# EAGLE schematic measure_board (EAGLE 7.2.0)
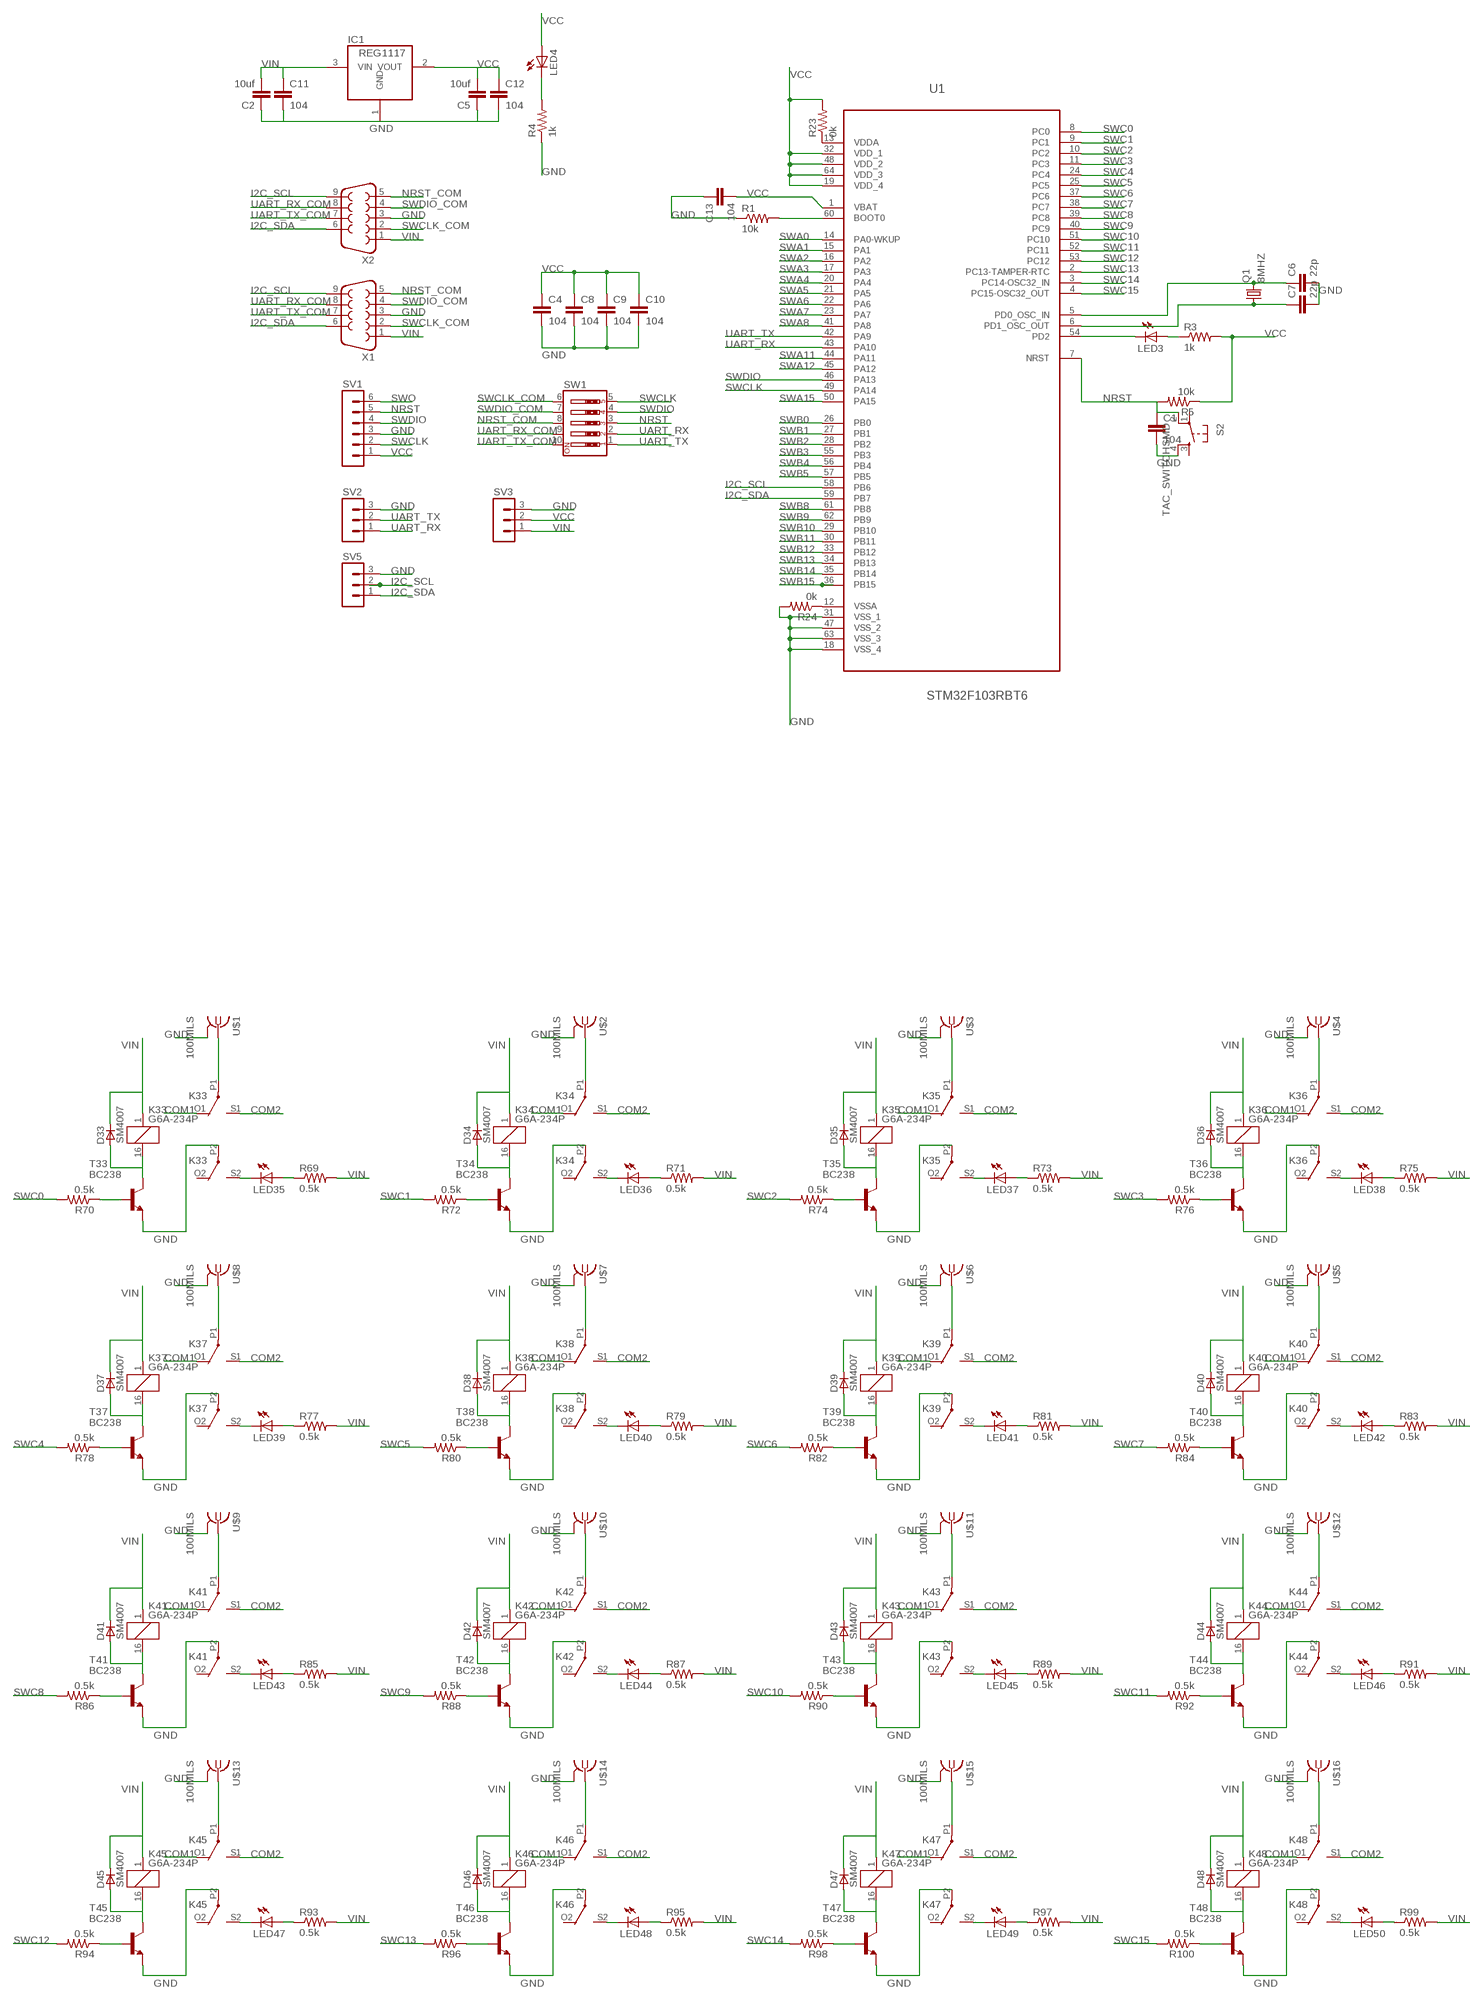
[diagram p0: schematic, sheet 1, part 1 of 2]
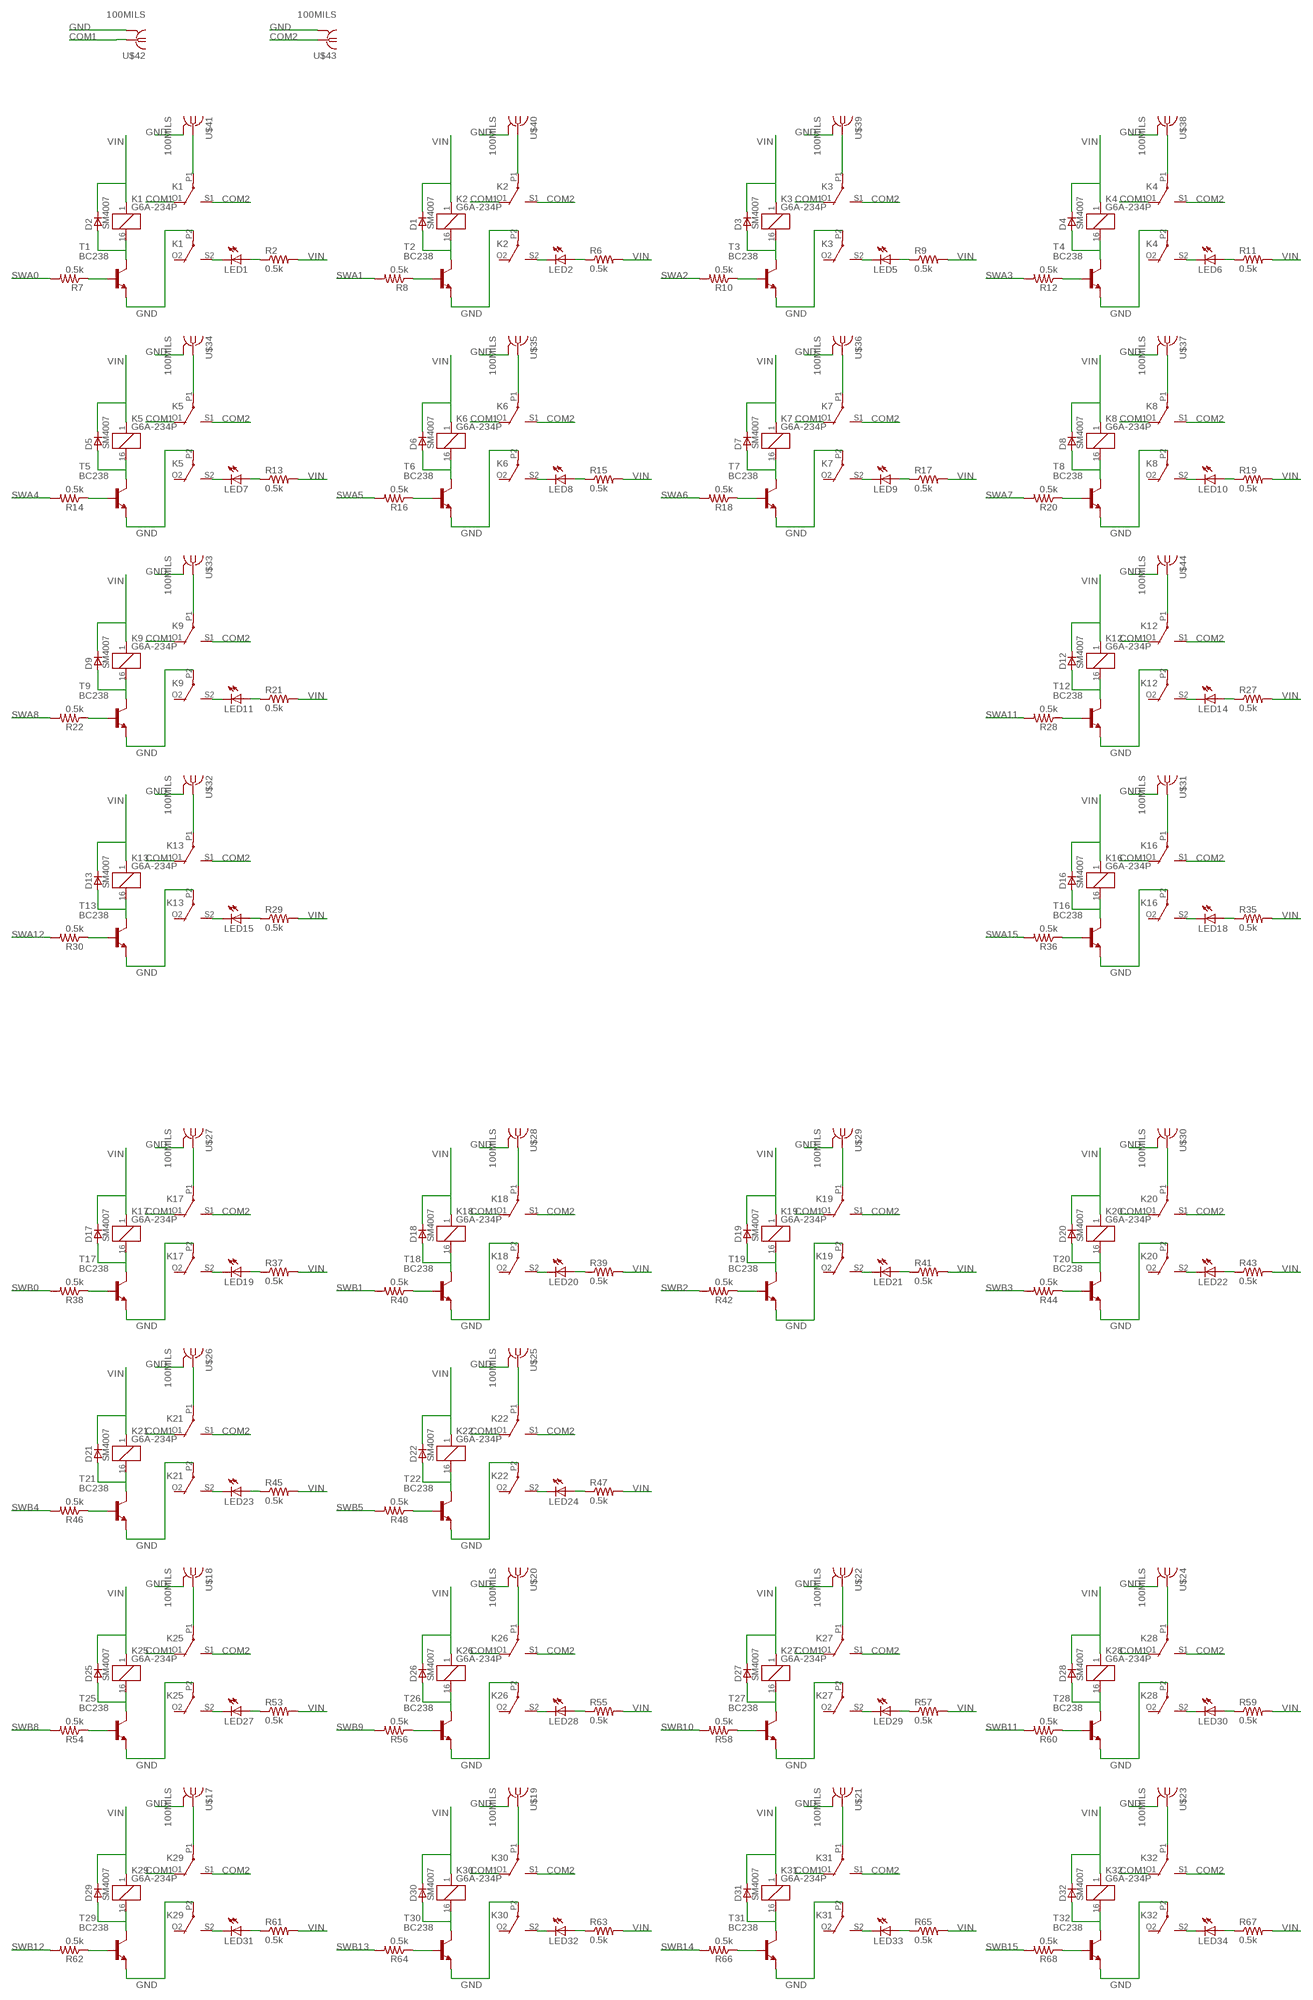
[diagram p1: schematic, sheet 1, part 2 of 2]

## Parts
C1  104  C-EUC0805  [C0805]
C2  10uf  C-EUC1206  [C1206]
C4  104  C-EUC0805  [C0805]
C5  10uf  C-EUC1206  [C1206]
C6  22p  C-EUC0805  [C0805]
C7  22p  C-EUC0805  [C0805]
C8  104  C-EUC0805  [C0805]
C9  104  C-EUC0805  [C0805]
C10  104  C-EUC0805  [C0805]
C11  104  C-EUC0805  [C0805]
C12  104  C-EUC0805  [C0805]
C13  104  C-EUC0805  [C0805]
D1  SM4007  [MELF-MLL41_DO213AB]
D2  SM4007  [MELF-MLL41_DO213AB]
D3  SM4007  [MELF-MLL41_DO213AB]
D4  SM4007  [MELF-MLL41_DO213AB]
D5  SM4007  [MELF-MLL41_DO213AB]
D6  SM4007  [MELF-MLL41_DO213AB]
D7  SM4007  [MELF-MLL41_DO213AB]
D8  SM4007  [MELF-MLL41_DO213AB]
D9  SM4007  [MELF-MLL41_DO213AB]
D12  SM4007  [MELF-MLL41_DO213AB]
D13  SM4007  [MELF-MLL41_DO213AB]
D16  SM4007  [MELF-MLL41_DO213AB]
D17  SM4007  [MELF-MLL41_DO213AB]
D18  SM4007  [MELF-MLL41_DO213AB]
D19  SM4007  [MELF-MLL41_DO213AB]
D20  SM4007  [MELF-MLL41_DO213AB]
D21  SM4007  [MELF-MLL41_DO213AB]
D22  SM4007  [MELF-MLL41_DO213AB]
D25  SM4007  [MELF-MLL41_DO213AB]
D26  SM4007  [MELF-MLL41_DO213AB]
D27  SM4007  [MELF-MLL41_DO213AB]
D28  SM4007  [MELF-MLL41_DO213AB]
D29  SM4007  [MELF-MLL41_DO213AB]
D30  SM4007  [MELF-MLL41_DO213AB]
D31  SM4007  [MELF-MLL41_DO213AB]
D32  SM4007  [MELF-MLL41_DO213AB]
D33  SM4007  [MELF-MLL41_DO213AB]
D34  SM4007  [MELF-MLL41_DO213AB]
D35  SM4007  [MELF-MLL41_DO213AB]
D36  SM4007  [MELF-MLL41_DO213AB]
D37  SM4007  [MELF-MLL41_DO213AB]
D38  SM4007  [MELF-MLL41_DO213AB]
D39  SM4007  [MELF-MLL41_DO213AB]
D40  SM4007  [MELF-MLL41_DO213AB]
D41  SM4007  [MELF-MLL41_DO213AB]
D42  SM4007  [MELF-MLL41_DO213AB]
D43  SM4007  [MELF-MLL41_DO213AB]
D44  SM4007  [MELF-MLL41_DO213AB]
D45  SM4007  [MELF-MLL41_DO213AB]
D46  SM4007  [MELF-MLL41_DO213AB]
D47  SM4007  [MELF-MLL41_DO213AB]
D48  SM4007  [MELF-MLL41_DO213AB]
IC1  REG1117  [SOT223]
K1  G6A-234P  [G6A-234P]
K2  G6A-234P  [G6A-234P]
K3  G6A-234P  [G6A-234P]
K4  G6A-234P  [G6A-234P]
K5  G6A-234P  [G6A-234P]
K6  G6A-234P  [G6A-234P]
K7  G6A-234P  [G6A-234P]
K8  G6A-234P  [G6A-234P]
K9  G6A-234P  [G6A-234P]
K12  G6A-234P  [G6A-234P]
K13  G6A-234P  [G6A-234P]
K16  G6A-234P  [G6A-234P]
K17  G6A-234P  [G6A-234P]
K18  G6A-234P  [G6A-234P]
K19  G6A-234P  [G6A-234P]
K20  G6A-234P  [G6A-234P]
K21  G6A-234P  [G6A-234P]
K22  G6A-234P  [G6A-234P]
K25  G6A-234P  [G6A-234P]
K26  G6A-234P  [G6A-234P]
K27  G6A-234P  [G6A-234P]
K28  G6A-234P  [G6A-234P]
K29  G6A-234P  [G6A-234P]
K30  G6A-234P  [G6A-234P]
K31  G6A-234P  [G6A-234P]
K32  G6A-234P  [G6A-234P]
K33  G6A-234P  [G6A-234P]
K34  G6A-234P  [G6A-234P]
K35  G6A-234P  [G6A-234P]
K36  G6A-234P  [G6A-234P]
K37  G6A-234P  [G6A-234P]
K38  G6A-234P  [G6A-234P]
K39  G6A-234P  [G6A-234P]
K40  G6A-234P  [G6A-234P]
K41  G6A-234P  [G6A-234P]
K42  G6A-234P  [G6A-234P]
K43  G6A-234P  [G6A-234P]
K44  G6A-234P  [G6A-234P]
K45  G6A-234P  [G6A-234P]
K46  G6A-234P  [G6A-234P]
K47  G6A-234P  [G6A-234P]
K48  G6A-234P  [G6A-234P]
LED1  LED3MM  [LED3MM]
LED2  LED3MM  [LED3MM]
LED3  LEDSML0805  [SML0805]
LED4  LEDSML0805  [SML0805]
LED5  LED3MM  [LED3MM]
LED6  LED3MM  [LED3MM]
LED7  LED3MM  [LED3MM]
LED8  LED3MM  [LED3MM]
LED9  LED3MM  [LED3MM]
LED10  LED3MM  [LED3MM]
LED11  LED3MM  [LED3MM]
LED14  LED3MM  [LED3MM]
LED15  LED3MM  [LED3MM]
LED18  LED3MM  [LED3MM]
LED19  LED3MM  [LED3MM]
LED20  LED3MM  [LED3MM]
LED21  LED3MM  [LED3MM]
LED22  LED3MM  [LED3MM]
LED23  LED3MM  [LED3MM]
LED24  LED3MM  [LED3MM]
LED27  LED3MM  [LED3MM]
LED28  LED3MM  [LED3MM]
LED29  LED3MM  [LED3MM]
LED30  LED3MM  [LED3MM]
LED31  LED3MM  [LED3MM]
LED32  LED3MM  [LED3MM]
LED33  LED3MM  [LED3MM]
LED34  LED3MM  [LED3MM]
LED35  LED3MM  [LED3MM]
LED36  LED3MM  [LED3MM]
LED37  LED3MM  [LED3MM]
LED38  LED3MM  [LED3MM]
LED39  LED3MM  [LED3MM]
LED40  LED3MM  [LED3MM]
LED41  LED3MM  [LED3MM]
LED42  LED3MM  [LED3MM]
LED43  LED3MM  [LED3MM]
LED44  LED3MM  [LED3MM]
LED45  LED3MM  [LED3MM]
LED46  LED3MM  [LED3MM]
LED47  LED3MM  [LED3MM]
LED48  LED3MM  [LED3MM]
LED49  LED3MM  [LED3MM]
LED50  LED3MM  [LED3MM]
Q1  8MHZ  CRYSTALHC49U70  [HC49U70]
R1  10k  R-US_M0805  [M0805]
R2  0.5k  R-US_M0805  [M0805]
R3  1k  R-US_M0805  [M0805]
R4  1k  R-US_M0805  [M0805]
R5  10k  R-US_M0805  [M0805]
R6  0.5k  R-US_M0805  [M0805]
R7  0.5k  R-US_M0805  [M0805]
R8  0.5k  R-US_M0805  [M0805]
R9  0.5k  R-US_M0805  [M0805]
R10  0.5k  R-US_M0805  [M0805]
R11  0.5k  R-US_M0805  [M0805]
R12  0.5k  R-US_M0805  [M0805]
R13  0.5k  R-US_M0805  [M0805]
R14  0.5k  R-US_M0805  [M0805]
R15  0.5k  R-US_M0805  [M0805]
R16  0.5k  R-US_M0805  [M0805]
R17  0.5k  R-US_M0805  [M0805]
R18  0.5k  R-US_M0805  [M0805]
R19  0.5k  R-US_M0805  [M0805]
R20  0.5k  R-US_M0805  [M0805]
R21  0.5k  R-US_M0805  [M0805]
R22  0.5k  R-US_M0805  [M0805]
R23  0k  R-US_M0805  [M0805]
R24  0k  R-US_M0805  [M0805]
R27  0.5k  R-US_M0805  [M0805]
R28  0.5k  R-US_M0805  [M0805]
R29  0.5k  R-US_M0805  [M0805]
R30  0.5k  R-US_M0805  [M0805]
R35  0.5k  R-US_M0805  [M0805]
R36  0.5k  R-US_M0805  [M0805]
R37  0.5k  R-US_M0805  [M0805]
R38  0.5k  R-US_M0805  [M0805]
R39  0.5k  R-US_M0805  [M0805]
R40  0.5k  R-US_M0805  [M0805]
R41  0.5k  R-US_M0805  [M0805]
R42  0.5k  R-US_M0805  [M0805]
R43  0.5k  R-US_M0805  [M0805]
R44  0.5k  R-US_M0805  [M0805]
R45  0.5k  R-US_M0805  [M0805]
R46  0.5k  R-US_M0805  [M0805]
R47  0.5k  R-US_M0805  [M0805]
R48  0.5k  R-US_M0805  [M0805]
R53  0.5k  R-US_M0805  [M0805]
R54  0.5k  R-US_M0805  [M0805]
R55  0.5k  R-US_M0805  [M0805]
R56  0.5k  R-US_M0805  [M0805]
R57  0.5k  R-US_M0805  [M0805]
R58  0.5k  R-US_M0805  [M0805]
R59  0.5k  R-US_M0805  [M0805]
R60  0.5k  R-US_M0805  [M0805]
R61  0.5k  R-US_M0805  [M0805]
R62  0.5k  R-US_M0805  [M0805]
R63  0.5k  R-US_M0805  [M0805]
R64  0.5k  R-US_M0805  [M0805]
R65  0.5k  R-US_M0805  [M0805]
R66  0.5k  R-US_M0805  [M0805]
R67  0.5k  R-US_M0805  [M0805]
R68  0.5k  R-US_M0805  [M0805]
R69  0.5k  R-US_M0805  [M0805]
R70  0.5k  R-US_M0805  [M0805]
R71  0.5k  R-US_M0805  [M0805]
R72  0.5k  R-US_M0805  [M0805]
R73  0.5k  R-US_M0805  [M0805]
R74  0.5k  R-US_M0805  [M0805]
R75  0.5k  R-US_M0805  [M0805]
R76  0.5k  R-US_M0805  [M0805]
R77  0.5k  R-US_M0805  [M0805]
R78  0.5k  R-US_M0805  [M0805]
R79  0.5k  R-US_M0805  [M0805]
R80  0.5k  R-US_M0805  [M0805]
R81  0.5k  R-US_M0805  [M0805]
R82  0.5k  R-US_M0805  [M0805]
R83  0.5k  R-US_M0805  [M0805]
R84  0.5k  R-US_M0805  [M0805]
R85  0.5k  R-US_M0805  [M0805]
R86  0.5k  R-US_M0805  [M0805]
R87  0.5k  R-US_M0805  [M0805]
R88  0.5k  R-US_M0805  [M0805]
R89  0.5k  R-US_M0805  [M0805]
R90  0.5k  R-US_M0805  [M0805]
R91  0.5k  R-US_M0805  [M0805]
R92  0.5k  R-US_M0805  [M0805]
R93  0.5k  R-US_M0805  [M0805]
R94  0.5k  R-US_M0805  [M0805]
R95  0.5k  R-US_M0805  [M0805]
R96  0.5k  R-US_M0805  [M0805]
R97  0.5k  R-US_M0805  [M0805]
R98  0.5k  R-US_M0805  [M0805]
R99  0.5k  R-US_M0805  [M0805]
R100  0.5k  R-US_M0805  [M0805]
S2  TAC_SWITCHSMD  [TACTILE-SWITCH-SMD]
SV1  MA06-1  [MA06-1]
SV2  MA03-1  [MA03-1]
SV3  MA03-1  [MA03-1]
SV5  MA03-1  [MA03-1]
SW1  SW_DIP-5  [EDG-05]
T1  BC238  [TO92]
T2  BC238  [TO92]
T3  BC238  [TO92]
T4  BC238  [TO92]
T5  BC238  [TO92]
T6  BC238  [TO92]
T7  BC238  [TO92]
T8  BC238  [TO92]
T9  BC238  [TO92]
T12  BC238  [TO92]
T13  BC238  [TO92]
T16  BC238  [TO92]
T17  BC238  [TO92]
T18  BC238  [TO92]
T19  BC238  [TO92]
T20  BC238  [TO92]
T21  BC238  [TO92]
T22  BC238  [TO92]
T25  BC238  [TO92]
T26  BC238  [TO92]
T27  BC238  [TO92]
T28  BC238  [TO92]
T29  BC238  [TO92]
T30  BC238  [TO92]
T31  BC238  [TO92]
T32  BC238  [TO92]
T33  BC238  [TO92]
T34  BC238  [TO92]
T35  BC238  [TO92]
T36  BC238  [TO92]
T37  BC238  [TO92]
T38  BC238  [TO92]
T39  BC238  [TO92]
T40  BC238  [TO92]
T41  BC238  [TO92]
T42  BC238  [TO92]
T43  BC238  [TO92]
T44  BC238  [TO92]
T45  BC238  [TO92]
T46  BC238  [TO92]
T47  BC238  [TO92]
T48  BC238  [TO92]
U1  STM32F103RBT6  [QFP50P1200X1200X160-64N]
U$1  100MILS  [100MIL]
U$2  100MILS  [100MIL]
U$3  100MILS  [100MIL]
U$4  100MILS  [100MIL]
U$5  100MILS  [100MIL]
U$6  100MILS  [100MIL]
U$7  100MILS  [100MIL]
U$8  100MILS  [100MIL]
U$9  100MILS  [100MIL]
U$10  100MILS  [100MIL]
U$11  100MILS  [100MIL]
U$12  100MILS  [100MIL]
U$13  100MILS  [100MIL]
U$14  100MILS  [100MIL]
U$15  100MILS  [100MIL]
U$16  100MILS  [100MIL]
U$17  100MILS  [100MIL]
U$18  100MILS  [100MIL]
U$19  100MILS  [100MIL]
U$20  100MILS  [100MIL]
U$21  100MILS  [100MIL]
U$22  100MILS  [100MIL]
U$23  100MILS  [100MIL]
U$24  100MILS  [100MIL]
U$25  100MILS  [100MIL]
U$26  100MILS  [100MIL]
U$27  100MILS  [100MIL]
U$28  100MILS  [100MIL]
U$29  100MILS  [100MIL]
U$30  100MILS  [100MIL]
U$31  100MILS  [100MIL]
U$32  100MILS  [100MIL]
U$33  100MILS  [100MIL]
U$34  100MILS  [100MIL]
U$35  100MILS  [100MIL]
U$36  100MILS  [100MIL]
U$37  100MILS  [100MIL]
U$38  100MILS  [100MIL]
U$39  100MILS  [100MIL]
U$40  100MILS  [100MIL]
U$41  100MILS  [100MIL]
U$42  100MILS  [100MIL]
U$43  100MILS  [100MIL]
U$44  100MILS  [100MIL]
X1  F09HP  [F09HP]
X2  F09HP  [F09HP]

## Nets
COM1: K1.O1(2:O) K2.O1(2:O) K3.O1(2:O) K4.O1(2:O) K5.O1(2:O) K6.O1(2:O) K7.O1(2:O) K8.O1(2:O) K9.O1(2:O) K12.O1(2:O) K13.O1(2:O) K16.O1(2:O) K17.O1(2:O) K18.O1(2:O) K19.O1(2:O) K20.O1(2:O) K21.O1(2:O) K22.O1(2:O) K25.O1(2:O) K26.O1(2:O) K27.O1(2:O) K28.O1(2:O) K29.O1(2:O) K30.O1(2:O) K31.O1(2:O) K32.O1(2:O) K33.O1(2:O) K34.O1(2:O) K35.O1(2:O) K36.O1(2:O) K37.O1(2:O) K38.O1(2:O) K39.O1(2:O) K40.O1(2:O) K41.O1(2:O) K42.O1(2:O) K43.O1(2:O) K44.O1(2:O) K45.O1(2:O) K46.O1(2:O) K47.O1(2:O) K48.O1(2:O) U$42.P$1
COM2: K1.S1(2:S) K2.S1(2:S) K3.S1(2:S) K4.S1(2:S) K5.S1(2:S) K6.S1(2:S) K7.S1(2:S) K8.S1(2:S) K9.S1(2:S) K12.S1(2:S) K13.S1(2:S) K16.S1(2:S) K17.S1(2:S) K18.S1(2:S) K19.S1(2:S) K20.S1(2:S) K21.S1(2:S) K22.S1(2:S) K25.S1(2:S) K26.S1(2:S) K27.S1(2:S) K28.S1(2:S) K29.S1(2:S) K30.S1(2:S) K31.S1(2:S) K32.S1(2:S) K33.S1(2:S) K34.S1(2:S) K35.S1(2:S) K36.S1(2:S) K37.S1(2:S) K38.S1(2:S) K39.S1(2:S) K40.S1(2:S) K41.S1(2:S) K42.S1(2:S) K43.S1(2:S) K44.S1(2:S) K45.S1(2:S) K46.S1(2:S) K47.S1(2:S) K48.S1(2:S) U$43.P$1
GND: C1.2 C2.1 C4.2 C5.1 C6.2 C7.2 C8.2 C9.2 C10.2 C11.2 C12.2 C13.1 IC1.1(GND) K1.P2(3:P) K2.P2(3:P) K3.P2(3:P) K4.P2(3:P) K5.P2(3:P) K6.P2(3:P) K7.P2(3:P) K8.P2(3:P) K9.P2(3:P) K12.P2(3:P) K13.P2(3:P) K16.P2(3:P) K17.P2(3:P) K18.P2(3:P) K19.P2(3:P) K20.P2(3:P) K21.P2(3:P) K22.P2(3:P) K25.P2(3:P) K26.P2(3:P) K27.P2(3:P) K28.P2(3:P) K29.P2(3:P) K30.P2(3:P) K31.P2(3:P) K32.P2(3:P) K33.P2(3:P) K34.P2(3:P) K35.P2(3:P) K36.P2(3:P) K37.P2(3:P) K38.P2(3:P) K39.P2(3:P) K40.P2(3:P) K41.P2(3:P) K42.P2(3:P) K43.P2(3:P) K44.P2(3:P) K45.P2(3:P) K46.P2(3:P) K47.P2(3:P) K48.P2(3:P) R1.1 R4.1 R24.2 S2.4 SV1.3 SV2.3 SV3.3 SV5.3 T1.1(E) T2.1(E) T3.1(E) T4.1(E) T5.1(E) T6.1(E) T7.1(E) T8.1(E) T9.1(E) T12.1(E) T13.1(E) T16.1(E) T17.1(E) T18.1(E) T19.1(E) T20.1(E) T21.1(E) T22.1(E) T25.1(E) T26.1(E) T27.1(E) T28.1(E) T29.1(E) T30.1(E) T31.1(E) T32.1(E) T33.1(E) T34.1(E) T35.1(E) T36.1(E) T37.1(E) T38.1(E) T39.1(E) T40.1(E) T41.1(E) T42.1(E) T43.1(E) T44.1(E) T45.1(E) T46.1(E) T47.1(E) T48.1(E) U1.18(VSS_4) U1.31(VSS_1) U1.47(VSS_2) U1.63(VSS_3) U$1.P$2(GND) U$1.P$3(GND) U$1.P$4(GND) U$1.P$5(GND) U$2.P$2(GND) U$2.P$3(GND) U$2.P$4(GND) U$2.P$5(GND) U$3.P$2(GND) U$3.P$3(GND) U$3.P$4(GND) U$3.P$5(GND) U$4.P$2(GND) U$4.P$3(GND) U$4.P$4(GND) U$4.P$5(GND) U$5.P$2(GND) U$5.P$3(GND) U$5.P$4(GND) U$5.P$5(GND) U$6.P$2(GND) U$6.P$3(GND) U$6.P$4(GND) U$6.P$5(GND) U$7.P$2(GND) U$7.P$3(GND) U$7.P$4(GND) U$7.P$5(GND) U$8.P$2(GND) U$8.P$3(GND) U$8.P$4(GND) U$8.P$5(GND) U$9.P$2(GND) U$9.P$3(GND) U$9.P$4(GND) U$9.P$5(GND) U$10.P$2(GND) U$10.P$3(GND) U$10.P$4(GND) U$10.P$5(GND) U$11.P$2(GND) U$11.P$3(GND) U$11.P$4(GND) U$11.P$5(GND) U$12.P$2(GND) U$12.P$3(GND) U$12.P$4(GND) U$12.P$5(GND) U$13.P$2(GND) U$13.P$3(GND) U$13.P$4(GND) U$13.P$5(GND) U$14.P$2(GND) U$14.P$3(GND) U$14.P$4(GND) U$14.P$5(GND) U$15.P$2(GND) U$15.P$3(GND) U$15.P$4(GND) U$15.P$5(GND) U$16.P$2(GND) U$16.P$3(GND) U$16.P$4(GND) U$16.P$5(GND) U$17.P$2(GND) U$17.P$3(GND) U$17.P$4(GND) U$17.P$5(GND) U$18.P$2(GND) U$18.P$3(GND) U$18.P$4(GND) U$18.P$5(GND) U$19.P$2(GND) U$19.P$3(GND) U$19.P$4(GND) U$19.P$5(GND) U$20.P$2(GND) U$20.P$3(GND) U$20.P$4(GND) U$20.P$5(GND) U$21.P$2(GND) U$21.P$3(GND) U$21.P$4(GND) U$21.P$5(GND) U$22.P$2(GND) U$22.P$3(GND) U$22.P$4(GND) U$22.P$5(GND) U$23.P$2(GND) U$23.P$3(GND) U$23.P$4(GND) U$23.P$5(GND) U$24.P$2(GND) U$24.P$3(GND) U$24.P$4(GND) U$24.P$5(GND) U$25.P$2(GND) U$25.P$3(GND) U$25.P$4(GND) U$25.P$5(GND) U$26.P$2(GND) U$26.P$3(GND) U$26.P$4(GND) U$26.P$5(GND) U$27.P$2(GND) U$27.P$3(GND) U$27.P$4(GND) U$27.P$5(GND) U$28.P$2(GND) U$28.P$3(GND) U$28.P$4(GND) U$28.P$5(GND) U$29.P$2(GND) U$29.P$3(GND) U$29.P$4(GND) U$29.P$5(GND) U$30.P$2(GND) U$30.P$3(GND) U$30.P$4(GND) U$30.P$5(GND) U$31.P$2(GND) U$31.P$3(GND) U$31.P$4(GND) U$31.P$5(GND) U$32.P$2(GND) U$32.P$3(GND) U$32.P$4(GND) U$32.P$5(GND) U$33.P$2(GND) U$33.P$3(GND) U$33.P$4(GND) U$33.P$5(GND) U$34.P$2(GND) U$34.P$3(GND) U$34.P$4(GND) U$34.P$5(GND) U$35.P$2(GND) U$35.P$3(GND) U$35.P$4(GND) U$35.P$5(GND) U$36.P$2(GND) U$36.P$3(GND) U$36.P$4(GND) U$36.P$5(GND) U$37.P$2(GND) U$37.P$3(GND) U$37.P$4(GND) U$37.P$5(GND) U$38.P$2(GND) U$38.P$3(GND) U$38.P$4(GND) U$38.P$5(GND) U$39.P$2(GND) U$39.P$3(GND) U$39.P$4(GND) U$39.P$5(GND) U$40.P$2(GND) U$40.P$3(GND) U$40.P$4(GND) U$40.P$5(GND) U$41.P$2(GND) U$41.P$3(GND) U$41.P$4(GND) U$41.P$5(GND) U$42.P$2(GND) U$42.P$3(GND) U$42.P$4(GND) U$42.P$5(GND) U$43.P$2(GND) U$43.P$3(GND) U$43.P$4(GND) U$43.P$5(GND) U$44.P$2(GND) U$44.P$3(GND) U$44.P$4(GND) U$44.P$5(GND) X1.3 X2.3
I2C_SCL: SV5.2 U1.58(PB6) X1.9 X2.9
I2C_SDA: SV5.1 U1.59(PB7) X1.6 X2.6
N$1: LED1.A R2.1
N$2: C6.1 Q1.2 U1.5(PD0_OSC_IN)
N$3: C7.1 Q1.1 U1.6(PD1_OSC_OUT)
N$4: R1.2 U1.60(BOOT0)
N$5: K1.P1(2:P) U$41.P$1
N$6: LED3.C U1.54(PD2)
N$7: LED3.A R3.1
N$8: LED2.A R6.1
N$9: LED4.C R4.2
N$10: D1.A K2.16 T2.3(C)
N$11: K1.S2(3:S) LED1.K(C)
N$12: R8.1 T2.2(B)
N$13: D2.A K1.16 T1.3(C)
N$14: K2.S2(3:S) LED2.K(C)
N$15: K2.P1(2:P) U$40.P$1
N$16: LED5.A R9.1
N$17: D3.A K3.16 T3.3(C)
N$18: R7.1 T1.2(B)
N$19: R10.1 T3.2(B)
N$20: K3.S2(3:S) LED5.K(C)
N$21: K3.P1(2:P) U$39.P$1
N$22: LED6.A R11.1
N$23: D4.A K4.16 T4.3(C)
N$24: R12.1 T4.2(B)
N$25: K4.S2(3:S) LED6.K(C)
N$26: K4.P1(2:P) U$38.P$1
N$27: LED7.A R13.1
N$28: D5.A K5.16 T5.3(C)
N$29: R14.1 T5.2(B)
N$30: K5.S2(3:S) LED7.K(C)
N$31: K5.P1(2:P) U$34.P$1
N$32: LED8.A R15.1
N$33: D6.A K6.16 T6.3(C)
N$34: R16.1 T6.2(B)
N$35: K6.S2(3:S) LED8.K(C)
N$36: K6.P1(2:P) U$35.P$1
N$37: LED9.A R17.1
N$38: D7.A K7.16 T7.3(C)
N$39: R18.1 T7.2(B)
N$40: K7.S2(3:S) LED9.K(C)
N$41: K7.P1(2:P) U$36.P$1
N$42: LED10.A R19.1
N$43: D8.A K8.16 T8.3(C)
N$44: R20.1 T8.2(B)
N$45: K8.S2(3:S) LED10.K(C)
N$46: K8.P1(2:P) U$37.P$1
N$47: LED11.A R21.1
N$48: D9.A K9.16 T9.3(C)
N$49: R22.1 T9.2(B)
N$50: K9.S2(3:S) LED11.K(C)
N$51: K9.P1(2:P) U$33.P$1
N$53: R23.1 U1.13(VDDA)
N$54: R24.1 U1.12(VSSA)
N$62: LED14.A R27.1
N$63: D12.A K12.16 T12.3(C)
N$64: R28.1 T12.2(B)
N$65: K12.S2(3:S) LED14.K(C)
N$66: K12.P1(2:P) U$44.P$1
N$67: LED15.A R29.1
N$68: D13.A K13.16 T13.3(C)
N$69: R30.1 T13.2(B)
N$70: K13.S2(3:S) LED15.K(C)
N$71: K13.P1(2:P) U$32.P$1
N$82: LED18.A R35.1
N$83: D16.A K16.16 T16.3(C)
N$84: R36.1 T16.2(B)
N$85: K16.S2(3:S) LED18.K(C)
N$86: K16.P1(2:P) U$31.P$1
N$87: LED19.A R37.1
N$88: D17.A K17.16 T17.3(C)
N$89: R38.1 T17.2(B)
N$90: K17.S2(3:S) LED19.K(C)
N$91: K17.P1(2:P) U$27.P$1
N$92: LED20.A R39.1
N$93: D18.A K18.16 T18.3(C)
N$94: R40.1 T18.2(B)
N$95: K18.S2(3:S) LED20.K(C)
N$96: K18.P1(2:P) U$28.P$1
N$97: LED21.A R41.1
N$98: D19.A K19.16 T19.3(C)
N$99: R42.1 T19.2(B)
N$100: K19.S2(3:S) LED21.K(C)
N$101: K19.P1(2:P) U$29.P$1
N$102: LED22.A R43.1
N$103: D20.A K20.16 T20.3(C)
N$104: R44.1 T20.2(B)
N$105: K20.S2(3:S) LED22.K(C)
N$106: K20.P1(2:P) U$30.P$1
N$107: LED23.A R45.1
N$108: D21.A K21.16 T21.3(C)
N$109: R46.1 T21.2(B)
N$110: K21.S2(3:S) LED23.K(C)
N$111: K21.P1(2:P) U$26.P$1
N$112: LED24.A R47.1
N$113: D22.A K22.16 T22.3(C)
N$114: R48.1 T22.2(B)
N$115: K22.S2(3:S) LED24.K(C)
N$116: K22.P1(2:P) U$25.P$1
N$127: LED27.A R53.1
N$128: D25.A K25.16 T25.3(C)
N$129: R54.1 T25.2(B)
N$130: K25.S2(3:S) LED27.K(C)
N$131: K25.P1(2:P) U$18.P$1
N$132: LED28.A R55.1
N$133: D26.A K26.16 T26.3(C)
N$134: R56.1 T26.2(B)
N$135: K26.S2(3:S) LED28.K(C)
N$136: K26.P1(2:P) U$20.P$1
N$137: LED29.A R57.1
N$138: D27.A K27.16 T27.3(C)
N$139: R58.1 T27.2(B)
N$140: K27.S2(3:S) LED29.K(C)
N$141: K27.P1(2:P) U$22.P$1
N$142: LED30.A R59.1
N$143: D28.A K28.16 T28.3(C)
N$144: R60.1 T28.2(B)
N$145: K28.S2(3:S) LED30.K(C)
N$146: K28.P1(2:P) U$24.P$1
N$147: LED31.A R61.1
N$148: D29.A K29.16 T29.3(C)
N$149: R62.1 T29.2(B)
N$150: K29.S2(3:S) LED31.K(C)
N$151: K29.P1(2:P) U$17.P$1
N$152: LED32.A R63.1
N$153: D30.A K30.16 T30.3(C)
N$154: R64.1 T30.2(B)
N$155: K30.S2(3:S) LED32.K(C)
N$156: K30.P1(2:P) U$19.P$1
N$157: LED33.A R65.1
N$158: D31.A K31.16 T31.3(C)
N$159: R66.1 T31.2(B)
N$160: K31.S2(3:S) LED33.K(C)
N$161: K31.P1(2:P) U$21.P$1
N$162: LED34.A R67.1
N$163: D32.A K32.16 T32.3(C)
N$164: R68.1 T32.2(B)
N$165: K32.S2(3:S) LED34.K(C)
N$166: K32.P1(2:P) U$23.P$1
N$167: LED35.A R69.1
N$168: D33.A K33.16 T33.3(C)
N$169: R70.1 T33.2(B)
N$170: K33.S2(3:S) LED35.K(C)
N$171: K33.P1(2:P) U$1.P$1
N$172: LED36.A R71.1
N$173: D34.A K34.16 T34.3(C)
N$174: R72.1 T34.2(B)
N$175: K34.S2(3:S) LED36.K(C)
N$176: K34.P1(2:P) U$2.P$1
N$177: LED37.A R73.1
N$178: D35.A K35.16 T35.3(C)
N$179: R74.1 T35.2(B)
N$180: K35.S2(3:S) LED37.K(C)
N$181: K35.P1(2:P) U$3.P$1
N$182: LED38.A R75.1
N$183: D36.A K36.16 T36.3(C)
N$184: R76.1 T36.2(B)
N$185: K36.S2(3:S) LED38.K(C)
N$186: K36.P1(2:P) U$4.P$1
N$187: LED39.A R77.1
N$188: D37.A K37.16 T37.3(C)
N$189: R78.1 T37.2(B)
N$190: K37.S2(3:S) LED39.K(C)
N$191: K37.P1(2:P) U$8.P$1
N$192: LED40.A R79.1
N$193: D38.A K38.16 T38.3(C)
N$194: R80.1 T38.2(B)
N$195: K38.S2(3:S) LED40.K(C)
N$196: K38.P1(2:P) U$7.P$1
N$197: LED41.A R81.1
N$198: D39.A K39.16 T39.3(C)
N$199: R82.1 T39.2(B)
N$200: K39.S2(3:S) LED41.K(C)
N$201: K39.P1(2:P) U$6.P$1
N$202: LED42.A R83.1
N$203: D40.A K40.16 T40.3(C)
N$204: R84.1 T40.2(B)
N$205: K40.S2(3:S) LED42.K(C)
N$206: K40.P1(2:P) U$5.P$1
N$207: LED43.A R85.1
N$208: D41.A K41.16 T41.3(C)
N$209: R86.1 T41.2(B)
N$210: K41.S2(3:S) LED43.K(C)
N$211: K41.P1(2:P) U$9.P$1
N$212: LED44.A R87.1
N$213: D42.A K42.16 T42.3(C)
N$214: R88.1 T42.2(B)
N$215: K42.S2(3:S) LED44.K(C)
N$216: K42.P1(2:P) U$10.P$1
N$217: LED45.A R89.1
N$218: D43.A K43.16 T43.3(C)
N$219: R90.1 T43.2(B)
N$220: K43.S2(3:S) LED45.K(C)
N$221: K43.P1(2:P) U$11.P$1
N$222: LED46.A R91.1
N$223: D44.A K44.16 T44.3(C)
N$224: R92.1 T44.2(B)
N$225: K44.S2(3:S) LED46.K(C)
N$226: K44.P1(2:P) U$12.P$1
N$227: LED47.A R93.1
N$228: D45.A K45.16 T45.3(C)
N$229: R94.1 T45.2(B)
N$230: K45.S2(3:S) LED47.K(C)
N$231: K45.P1(2:P) U$13.P$1
N$232: LED48.A R95.1
N$233: D46.A K46.16 T46.3(C)
N$234: R96.1 T46.2(B)
N$235: K46.S2(3:S) LED48.K(C)
N$236: K46.P1(2:P) U$14.P$1
N$237: LED49.A R97.1
N$238: D47.A K47.16 T47.3(C)
N$239: R98.1 T47.2(B)
N$240: K47.S2(3:S) LED49.K(C)
N$241: K47.P1(2:P) U$15.P$1
N$242: LED50.A R99.1
N$243: D48.A K48.16 T48.3(C)
N$244: R100.1 T48.2(B)
N$245: K48.S2(3:S) LED50.K(C)
N$246: K48.P1(2:P) U$16.P$1
NRST: C1.1 R5.2 S2.2 SV1.5 SW1.3 U1.7(NRST)
NRST_COM: SW1.8 X1.5 X2.5
SWA0: R7.2 U1.14(PA0-WKUP)
SWA1: R8.2 U1.15(PA1)
SWA2: R10.2 U1.16(PA2)
SWA3: R12.2 U1.17(PA3)
SWA4: R14.2 U1.20(PA4)
SWA5: R16.2 U1.21(PA5)
SWA6: R18.2 U1.22(PA6)
SWA7: R20.2 U1.23(PA7)
SWA8: R22.2 U1.41(PA8)
SWA11: R28.2 U1.44(PA11)
SWA12: R30.2 U1.45(PA12)
SWA15: R36.2 U1.50(PA15)
SWB0: R38.2 U1.26(PB0)
SWB1: R40.2 U1.27(PB1)
SWB2: R42.2 U1.28(PB2)
SWB3: R44.2 U1.55(PB3)
SWB4: R46.2 U1.56(PB4)
SWB5: R48.2 U1.57(PB5)
SWB8: R54.2 U1.61(PB8)
SWB9: R56.2 U1.62(PB9)
SWB10: R58.2 U1.29(PB10)
SWB11: R60.2 U1.30(PB11)
SWB12: R62.2 U1.33(PB12)
SWB13: R64.2 U1.34(PB13)
SWB14: R66.2 U1.35(PB14)
SWB15: R68.2 U1.36(PB15)
SWC0: R70.2 U1.8(PC0)
SWC1: R72.2 U1.9(PC1)
SWC2: R74.2 U1.10(PC2)
SWC3: R76.2 U1.11(PC3)
SWC4: R78.2 U1.24(PC4)
SWC5: R80.2 U1.25(PC5)
SWC6: R82.2 U1.37(PC6)
SWC7: R84.2 U1.38(PC7)
SWC8: R86.2 U1.39(PC8)
SWC9: R88.2 U1.40(PC9)
SWC10: R90.2 U1.51(PC10)
SWC11: R92.2 U1.52(PC11)
SWC12: R94.2 U1.53(PC12)
SWC13: R96.2 U1.2(PC13-TAMPER-RTC)
SWC14: R98.2 U1.3(PC14-OSC32_IN)
SWC15: R100.2 U1.4(PC15-OSC32_OUT)
SWCLK: SV1.2 SW1.5 U1.49(PA14)
SWCLK_COM: SW1.6 X1.2 X2.2
SWDIO: SV1.4 SW1.4 U1.46(PA13)
SWDIO_COM: SW1.7 X1.4 X2.4
SWO: SV1.6
UART_RX: SV2.1 SW1.2 U1.43(PA10)
UART_RX_COM: SW1.9 X1.8 X2.8
UART_TX: SV2.2 SW1.1 U1.42(PA9)
UART_TX_COM: SW1.10 X1.7 X2.7
VCC: C4.1 C5.2 C8.1 C9.1 C10.1 C12.1 C13.2 IC1.2(VOUT) LED4.A R3.2 R5.1 R23.2 SV1.1 SV3.2 U1.1(VBAT) U1.19(VDD_4) U1.32(VDD_1) U1.48(VDD_2) U1.64(VDD_3)
VIN: C2.2 C11.1 D1.C D2.C D3.C D4.C D5.C D6.C D7.C D8.C D9.C D12.C D13.C D16.C D17.C D18.C D19.C D20.C D21.C D22.C D25.C D26.C D27.C D28.C D29.C D30.C D31.C D32.C D33.C D34.C D35.C D36.C D37.C D38.C D39.C D40.C D41.C D42.C D43.C D44.C D45.C D46.C D47.C D48.C IC1.3(VIN) K1.1 K2.1 K3.1 K4.1 K5.1 K6.1 K7.1 K8.1 K9.1 K12.1 K13.1 K16.1 K17.1 K18.1 K19.1 K20.1 K21.1 K22.1 K25.1 K26.1 K27.1 K28.1 K29.1 K30.1 K31.1 K32.1 K33.1 K34.1 K35.1 K36.1 K37.1 K38.1 K39.1 K40.1 K41.1 K42.1 K43.1 K44.1 K45.1 K46.1 K47.1 K48.1 R2.2 R6.2 R9.2 R11.2 R13.2 R15.2 R17.2 R19.2 R21.2 R27.2 R29.2 R35.2 R37.2 R39.2 R41.2 R43.2 R45.2 R47.2 R53.2 R55.2 R57.2 R59.2 R61.2 R63.2 R65.2 R67.2 R69.2 R71.2 R73.2 R75.2 R77.2 R79.2 R81.2 R83.2 R85.2 R87.2 R89.2 R91.2 R93.2 R95.2 R97.2 R99.2 SV3.1 X1.1 X2.1
Unconnected: K1.O2(3:O) K2.O2(3:O) K3.O2(3:O) K4.O2(3:O) K5.O2(3:O) K6.O2(3:O) K7.O2(3:O) K8.O2(3:O) K9.O2(3:O) K12.O2(3:O) K13.O2(3:O) K16.O2(3:O) K17.O2(3:O) K18.O2(3:O) K19.O2(3:O) K20.O2(3:O) K21.O2(3:O) K22.O2(3:O) K25.O2(3:O) K26.O2(3:O) K27.O2(3:O) K28.O2(3:O) K29.O2(3:O) K30.O2(3:O) K31.O2(3:O) K32.O2(3:O) K33.O2(3:O) K34.O2(3:O) K35.O2(3:O) K36.O2(3:O) K37.O2(3:O) K38.O2(3:O) K39.O2(3:O) K40.O2(3:O) K41.O2(3:O) K42.O2(3:O) K43.O2(3:O) K44.O2(3:O) K45.O2(3:O) K46.O2(3:O) K47.O2(3:O) K48.O2(3:O) S2.1 S2.3

## Library data of the parts
C1 C4 C6-C13 = resistor:C-EU: CAPACITOR, European symbol
C2 C5 = rcl:C-EU: CAPACITOR, European symbol
D1-D9 D12 D13 D16-D22 D25-D48 = _hhn_diodes_smd:SM400*: SM4001 .. SM4007 General Purpose Rectifier, 1 A SMD-Version of 1N4001 .. 1N4007 Case: MELF-MLL41 = DO 213 AB Author: Dipl.-Ing. FH Rainer Bayer HHN Hochschule Heilbronn, rainer.bayer@hs-heilbronn.de Ingenieurbüro ing-rb, mail@ing-rb.de
IC1 = burr-brown:REG1117: 800mA and 1A Low Dropout (LDO) Positive Regulator 1.8V, 2.5V, 2.85V, 3.3V, 5V, and Adj; MPN: REG1117; OC_FARNELL: 1097566; OC_NEWARK: 14P6981
K1-K9 K12 K13 K16-K22 K25-K48 = relay:G6A-234P: RELAY 2 x switch, 0.3 A/125 V AC, 1 A/30 V DC, Omron; OC_FARNELL: unknown; OC_NEWARK: unknown
LED1-LED11 LED14 LED15 LED18-LED24 LED27-LED50 = led:LED: LED OSRAM: - CHIPLED LG R971, LG N971, LY N971, LG Q971, LY Q971, LO R971, LY R971 LH N974, LH R974 LS Q976, LO Q976, LY Q976 LO Q996 - Hyper CHIPLED LW Q18S LB Q993, LB Q99A, LB R99A - SideLED LS A670, LO A670, LY A670, LG A670, LP A670 LB A673, LV A673, LT A673, LW A673 LH A674 LY A675 LS A676, LA A676, LO A676, LY A676, LW A676 LS A679, LY A679, LG A679 - Hyper Micro SIDELED® LS Y876, LA Y876, LO Y876, LY Y876 LT Y87S - SmartLED LW L88C, LW L88S LB L89C, LB L89S, LG L890 LS L89K, LO L89K, LY L89K LS L896, LA L896, LO L896, LY L896 - TOPLED LS T670, LO T670, LY T670, LG T670, LP T670 LSG T670, LSP T670, LSY T670, LOP T670, LYG T670 LG T671, LOG T671, LSG T671 LB T673, LV T673, LT T673, LW T673 LH T674 LS T676, LA T676, LO T676, LY T676, LB T676, LH T676, LSB T676, LW T676 LB T67C, LV T67C, LT T67C, LS T67K, LO T67K, LY T67K, LW E67C LS E67B, LA E67B, LO E67B, LY E67B, LB E67C, LV E67C, LT E67C LW T67C LS T679, LY T679, LG T679 LS T770, LO T770, LY T770, LG T770, LP T770 LB T773, LV T773, LT T773, LW T773 LH T774 LS E675, LA E675, LY E675, LS T675 LS T776, LA T776, LO T776, LY T776, LB T776 LHGB T686 LT T68C, LB T68C - Hyper Mini TOPLED® LB M676 - Mini TOPLED Santana® LG M470 LS M47K, LO M47K, LY M47K Source: http://www.osram.convergy.de LUXEON: - LUMILED® LXK2-PW12-R00, LXK2-PW12-S00, LXK2-PW14-U00, LXK2-PW14-V00 LXK2-PM12-R00, LXK2-PM12-S00, LXK2-PM14-U00 LXK2-PE12-Q00, LXK2-PE12-R00, LXK2-PE12-S00, LXK2-PE14-T00, LXK2-PE14-U00 LXK2-PB12-K00, LXK2-PB12-L00, LXK2-PB12-M00, LXK2-PB14-N00, LXK2-PB14-P00, LXK2-PB14-Q00 LXK2-PR12-L00, LXK2-PR12-M00, LXK2-PR14-Q00, LXK2-PR14-R00 LXK2-PD12-Q00, LXK2-PD12-R00, LXK2-PD12-S00 LXK2-PH12-R00, LXK2-PH12-S00 LXK2-PL12-P00, LXK2-PL12-Q00, LXK2-PL12-R00 Source: www.luxeon.com KINGBRIGHT: KA-3528ASYC Source: www.kingbright.com
Q1 = crystal:CRYSTAL: CRYSTAL; OC_FARNELL: unknown; OC_NEWARK: unknown
R1-R24 R27-R30 R35-R48 R53-R100 = resistor:R-US_: RESISTOR, American symbol
S2 = SparkFun-Retired:TAC_SWITCH: Momentary Switch Button commonly used for reset or general input. Spark Fun Electronics SKU : COM-00097 SMT- SWCH-08247; PROD_ID: SWCH-08247
SV1 = con-lstb:MA06-1: PIN HEADER; OC_FARNELL: unknown; OC_NEWARK: unknown
SV2 SV3 SV5 = con-lstb:MA03-1: PIN HEADER; OC_FARNELL: unknown; OC_NEWARK: unknown
SW1 = special:SW_DIP-5: DIP SWITCH
T1-T9 T12 T13 T16-T22 T25-T48 = transistor-neu-to92:BC238: NPN TRANSISTOR
U1 = ST Microelctronics_By_element14_Batch_1:STM32F103RBT6: 32BIT MCU; MPN: STM32F103RBT6; OC_FARNELL: 1447640; OC_NEWARK: 59M2183; PACKAGE: LQFP-64; SUPPLIER: STMICROELECTRONICS
U$1-U$44 = con-coax:100MILS
X1 X2 = con-subd:F09: SUB-D; OC_FARNELL: unknown; OC_NEWARK: unknown